# Altium schematic sheet H17R0_Frontend.SchDoc: H17R0
size Letter; CompanyName: Hexabitz; DocumentNumber: 2; Revision: 1; SheetNumber: 2; SheetTotal: 3
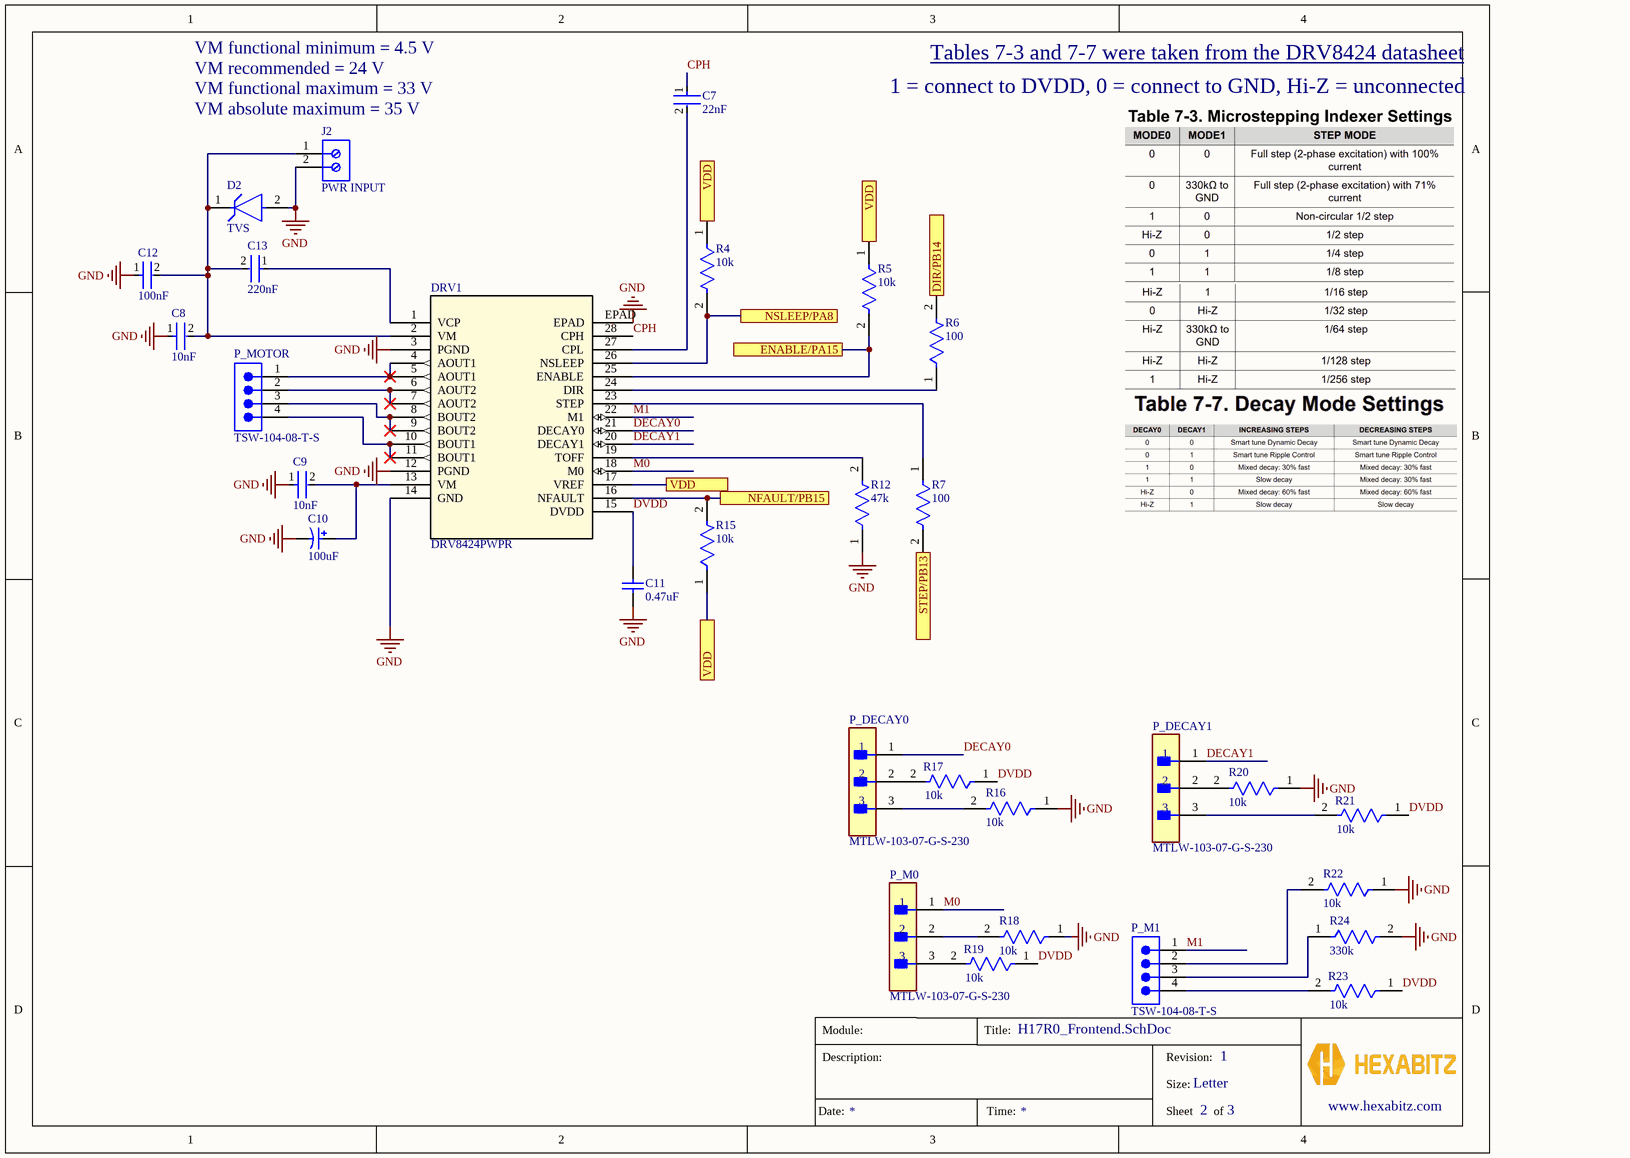
[diagram p0: H17R0_Frontend.SchDoc]

## Parts
C7  22nF  [FP-C0603C-CF-MFG]
C8  10nF  [FP-CGA3E-0_3-0_1-IPC_B]
C9  10nF  [FP-CGA3E-0_3-0_1-IPC_B]
C10  100uF  [CAPPR65-500-1600X1000X1700]
C11  0.47uF  [CAPC1608X87X35LL15T15]
C12  100nF  [FP-CGA3E-0_3-0_1-MFG]
C13  220nF  [FP-CGA3E-0_3-0_1-IPC_A]
D2  TVS  [FP-SMBJ-MFG]
DRV1  DRV8424PWPR  [SOIC_24PWPR_TEX]
J2  PWR INPUT  [PHOE-1725656-2]
P_DECAY0  MTLW-103-07-G-S-230  [FP-MTLW-103-07-G-S-230-MFG]
P_DECAY1  MTLW-103-07-G-S-230  [FP-MTLW-103-07-G-S-230-MFG]
P_M0  MTLW-103-07-G-S-230  [FP-MTLW-103-07-G-S-230-MFG]
P_M1  TSW-104-08-T-S  [SMTC-TSW-104-08-X-S]
P_MOTOR  TSW-104-08-T-S  [SMTC-TSW-104-08-X-S]
R4  10k  [FP-CRGCQ0603-IPC_C]
R5  10k  [FP-CRGCQ0603-IPC_C]
R6  100  [FP-RMCF0603-IPC_A]
R7  100  [FP-RMCF0603-IPC_A]
R12  47k  [FP-ESR03-IPC_C]
R15  10k  [FP-CRGCQ0603-IPC_C]
R16  10k  [FP-CRGCQ0603-IPC_C]
R17  10k  [FP-CRGCQ0603-IPC_C]
R18  10k  [FP-CRGCQ0603-IPC_C]
R19  10k  [FP-CRGCQ0603-IPC_C]
R20  10k  [FP-CRGCQ0603-IPC_C]
R21  10k  [FP-CRGCQ0603-IPC_C]
R22  10k  [FP-CRGCQ0603-IPC_C]
R23  10k  [FP-CRGCQ0603-IPC_C]
R24  330k  [FP-ESR03-IPC_C]

## Ports
DIR/PB14, ENABLE/PA15, NFAULT/PB15, NSLEEP/PA8, STEP/PB13, VDD

## Nets
GND: C8.1 C9.1 C10.2 C11.1 C12.1 D2.2(A) DRV1.3(PGND) DRV1.12(PGND) DRV1.14(GND) DRV1.EPAD J2.2 R12.1 R16.1 R18.1 R20.1 R22.1 R24.2
CPH: C7.1 DRV1.28(CPH)
DECAY0: DRV1.21(DECAY0) P_DECAY0.1
DECAY1: DRV1.20(DECAY1) P_DECAY1.1
DIR/PB14: R6.2 ; port DIR/PB14
DVDD: C11.2 DRV1.15(DVDD) R17.1 R19.1 R21.1 R23.1
ENABLE/PA15: DRV1.25(ENABLE) R5.2 ; port ENABLE/PA15
M0: DRV1.18(M0) P_M0.1
M1: DRV1.22(M1) P_M1.1
NFAULT/PB15: DRV1.16(NFAULT) R15.2 ; port NFAULT/PB15
NSLEEP/PA8: DRV1.26(NSLEEP) R4.2 ; port NSLEEP/PA8
STEP/PB13: R7.2 ; port STEP/PB13
VDD: DRV1.17(VREF) R4.1 R5.1 R15.1 ; port VDD
NetC7_2: C7.2 DRV1.27(CPL)
NetC8_2: C8.2 C12.2 C13.2 D2.1(C) DRV1.2(VM) J2.1
NetC9_2: C9.2 C10.1 DRV1.13(VM)
NetC13_1: C13.1 DRV1.1(VCP)
NetDRV1_4: DRV1.4(AOUT1) DRV1.5(AOUT1) P_MOTOR.1
NetDRV1_6: DRV1.6(AOUT2) DRV1.7(AOUT2) P_MOTOR.2
NetDRV1_8: DRV1.8(BOUT2) DRV1.9(BOUT2) P_MOTOR.3
NetDRV1_10: DRV1.10(BOUT1) DRV1.11(BOUT1) P_MOTOR.4
NetDRV1_19: DRV1.19(TOFF) R12.2
NetDRV1_23: DRV1.23(STEP) R7.1
NetDRV1_24: DRV1.24(DIR) R6.1
NetP_DECAY0_2: P_DECAY0.2 R17.2
NetP_DECAY0_3: P_DECAY0.3 R16.2
NetP_DECAY1_2: P_DECAY1.2 R20.2
NetP_DECAY1_3: P_DECAY1.3 R21.2
NetP_M0_2: P_M0.2 R18.2
NetP_M0_3: P_M0.3 R19.2
NetP_M1_2: P_M1.2 R22.2
NetP_M1_3: P_M1.3 R24.1
NetP_M1_4: P_M1.4 R23.2

## Notes on the sheet
- VM functional minimum = 4.5 V
- VM recommended = 24 V
- VM functional maximum = 33 V
- 1 = connect to DVDD, 0 = connect to GND, Hi-Z = unconnected
- Tables 7-3 and 7-7 were taken from the DRV8424 datasheet <https://www.ti.com/lit/ds/symlink/drv8424.pdf?ts=1762636116343&ref_url=https%253A%252F%252Fwww.ti.com%252Fproduct%252FDRV8424>
- (near J2) VM absolute maximum = 35 V
- Module:
- Title:
- Description:
- Size:
- Revision:
- Letter
- www.hexabitz.com
- Date:
- Time:
- Sheet
- of

## Library data of the parts
C7 = CMP-1035-02417-2: C0603 22,000 pF X7R 30ppm/°C 10.00% 16 V; Manufacturer: KEMET; Manufacturer Part Number: C0603C223K4RAC; Tolerance: 0.1; Automotive Grade: Grade 1; Material: Ceramic; Voltage Rating: 16 V; Lead Free: Yes; Value: 22,000 pF; Automotive: Yes; Device Class L2: Capacitors; Temperature Range Low: -55°C; Octopart: https://octopart.com/c0603c223k4rac-kemet-967635; Mouser Description: Multilayer Ceramic Capacitors MLCC - SMD/SMT 16volts 0.022uF 10% X7R; Category: Cap; Height: 0.87mm; Temperature Characteristic: X7R; Temperature: -55°C to +125°C; Temperature Coefficient: 30ppm/°C; Temperature Range High: +125°C; Device Class L3: Ceramic Capacitors; Package: C0603C-CF; Device Class L1: Passive Components; ComponentLink2URL: https://api.kemet.com/component-edge/download/datasheet/C0603C100J5GACAUTO.pdf; RoHS: TRUE; Capacitance: 22,000 pF; ComponentLink2Description: Datasheet
C8 C9 = CMP-08246-000510-1: Cap Ceramic 10nF 50V X7R 10% Pad SMD 0603 +125°C Automotive T/R; MPN: CGA3E2X7R1H103K080AE; MFN: TDK; Termination: SMD/SMT; Min Operating Temperature: -55°C; Weight: 7.1E-05oz; Capacitance: 10nF; Mount: Surface Mount; Package Quantity: 4000; Max Operating Temperature: 125°C; Voltage Rating: 50V; Tolerance: 10%; Packaging: Tape and Reel; Height: 0.8mm; Length: 0.063inch; Features: Soft Termination; Voltage Rating (DC): 50V; Case/Package: 0603; Thickness: 0.035inch; Ratings: AEC-Q200; Case Code (Imperial): 0603; Width: 0.031inch; Dielectric: X7R; Case Code (Metric): 1608
  C8: Octopart URL: https://octopart.com/part/tdk/CGA3E2X7R1H103K080AE
  C9: Octopart URL: https://octopart.com/cga3e2x7r1h103k080ae-tdk-31387966
C10 = CMP-1665-00044-1: Aluminum Electrolytic Capacitor, 100 uF, +/- 20%, 100 V, -40 to 85 degC, 2-Pin THD, RoHS, Bulk; MPN: ECA-2AM101; Power Rating: 250 mW; Tolerance: 1%; Resistance: 100 Ohm; Type (Resistor): Carbon Film; Voltage Rating: 250 V; Case\Package: Axial; MFN: Panasonic; RoHSCompliant: true; Max Operating Temperature: 155 degC; DatasheetVersion: Mar-16; PackageDescription: 2-Pin Through Hole Device, Dia 10 mm, Body Length 16 mm; ComponentLink1Description: Manufacturer URL; Package Quantity: 200; Mount: Through Hole; ComponentLink2URL: https://industrial.panasonic.com/cdbs/www-data/pdf/RDF0000/ABA0000C1047.pdf; Packaging: Bulk; Length: 0.248 inch; PackageReference: CAPPR65-500-1600X1000X1700; ComponentLink2Description: Datasheet; Min Operating Temperature: -55 degC; ComponentLink1URL: http://www.panasonic.com/; Octopart URL: https://octopart.com/part/panasonic/ECA-2AM101
C11 = CMP-2006-03770-1: Ceramic Capacitor, Multilayer, Ceramic, 6.3V, 10% +Tol, 10% -Tol, X7R, 15% TC, 0.47uF, Surface Mount, 0603; Part Number: C0603C474K9RACTU; Manufacturer: Kemet; Octopart URL: https://octopart.com/part/kemet/C0603C474K9RACTU
C12 = CMP-08246-001259-1: Cap Ceramic 100nF 50V X7R 10% Pad SMD 0603 +125°C Automotive T/R; MPN: CGA3E2X7R1H104K080AD; MFN: TDK; Weight: 7.1E-05oz; Case Code (Imperial): 0603; Min Operating Temperature: -55°C; Packaging: Tape and Reel; Dielectric: X7R; Tolerance: 10%; Case Code (Metric): 1608; Max Operating Temperature: 125°C; Composition: Ceramic; Capacitance: 100nF; Termination: SMD/SMT; Length: 1.6mm; Height: 0.8mm; Case/Package: 0603; Thickness: 0.035inch; Mount: Surface Mount; Voltage Rating (DC): 50V; Width: 0.8mm; Ratings: AEC-Q200; Voltage Rating: 50V; Depth: 0.8mm; Package Quantity: 4000; Octopart URL: https://octopart.com/part/tdk/CGA3E2X7R1H104K080AD
C13 = CMP-08246-000144-1: Cap Ceramic 220nF 16V X7R 10% Pad SMD 0603 +125°C Automotive T/R; MPN: CGA3E2X7R1C224K080AA; MFN: TDK; Capacitance: 220nF; Voltage Rating: 16V; REACH SVHC: No SVHC; Length: 1.6mm; Packaging: Tape and Reel; Depth: 0.8mm; Tolerance: 10%; Mount: Surface Mount; Dielectric: X7R; Weight: 7.1E-05oz; Thickness: 0.035inch; Voltage Rating (DC): 16V; Case/Package: 0603; Case Code (Imperial): 0603; Min Operating Temperature: -55°C; Height: 0.8mm; Max Operating Temperature: 125°C; Ratings: AEC-Q200; Package Quantity: 1; Case Code (Metric): 1608; Width: 0.8mm; Termination: SMD/SMT; Composition: Ceramic; Octopart URL: https://octopart.com/part/tdk/CGA3E2X7R1C224K080AA
D2 = CMP-2000-07095-2: TVS DIODE 33V 53.3V DO214AA; Manufacturer Part Number: SMBJ33A; Manufacturer: Littelfuse Inc; Max Junction Temp: +150°C; Number Of Channels: 1; Breakdown Voltage: 36.7V; Peak Pulse Power: 600W; Direction: Unidirectional; Peak Pulse Current: 11.3A; Lead Free: Yes; Height: 2.61mm; Temperature Range Low: -65°C; ComponentLink2URL: https://www.littelfuse.com/~/media/electronics/datasheets/tvs_diodes/littelfuse_tvs_diode_smbj_datasheet.pdf.pdf; Clamping Voltage: 53.3V; Device Class L1: Circuit Protection; Octopart: https://octopart.com/smbj33a-littelfuse-350829; Device Class L2: TVS Diodes; Digikey Description: TVS DIODE 33V 53.3V DO214AA; Automotive: No; Temperature Range High: +150°C; Package: SMBJ; ComponentLink2Description: Datasheet; Mouser Description: TVS DIODE 33V 53.3V DO214AA; Reverse Standoff Voltage: 33V; Category: Diode; Device Class L3: unset; Temperature: -65°C to +150°C; RoHS: TRUE; Octopart URL: https://octopart.com/part/littelfuse/SMBJ33A
DRV1 = DRV8424PWPR: 35-V, 2.5-A bipolar stepper driver with integrated current sensing & 1/256 microstepping 28-HTSSOP -40 to 125; Manufacturer_Name: Texas Instruments; Copyright: Copyright (C) 2025 Ultra Librarian. All rights reserved.; Manufacturer_Part_Number: DRV8424PWPR; Datasheet: https://www.ti.com/lit/gpn/drv8424; RefDes: RefDes; Type: Type
J2 = CMP-2000-05299-1: Male Header, Pitch 2.54 mm, 1 x 2 Position, Height 9 mm, Tail Length 3.5 mm; Manufacturer part No.: 1725656; Manufacturer: Phoenix Contact; Number of contacts: 2; Content: 250pc(s); Pitch: 2.54mm; Industrial packaging: Yes; Colour: Green; Type: MPT0,5/2-2,54; Datasheet URL: http://datasheet.octopart.com/1725656-Phoenix-Contact-datasheet-5302866.pdf; Manufacturer URL: http://www.phoenixcontact.com/; Datasheet Version: Apr-08; Octopart URL: https://octopart.com/part/phoenix-contact/1725656
P_DECAY0 P_DECAY1 P_M0 = CMP-02766-001679-1: CONN HEADER VERT 3POS 2.54MM; Max Current Rating: 3A; Number of Contacts: 3; Gender: Male; MFN: Samtec; Contact Material: Bronze; Pitch: 2.54mm; Housing Material: Polymer; Contact Plating: Gold; Radiation Hardening: No; Depth: 2.48mm; Packaging: Bulk; Number of Rows: 1; Max Operating Temperature: 125°C; Housing Color: Black; Termination: Solder; Min Operating Temperature: -55°C; Length: 7.62mm; RoHS Compliant: Yes; Orientation: Straight; Octopart URL: https://octopart.com/part/samtec/MTLW-103-07-G-S-230; MPN: MTLW-103-07-G-S-230
P_M1 P_MOTOR = CMP-1024-00356-1: 0.025" SQ Post Header, Through-hole, Vertical, -55 to 105 degC, 2.54 mm Pitch, 4-Pin, Male, RoHS; Manufacturer: Samtec; Pitch: 2.54 mm; PackageDescription: .025[0.64] SQ. Post Terminal Strip Assembly; ComponentLink2URL: http://www.samtec.com/documents/webfiles/pdf/TSW_TH.PDF; ComponentLink3URL: http://www.samtec.com/documents/webfiles/cpdf/TSW-XXX-XX-XXX-X-XX-XXX-MKT.pdf; PackageVersion: DM, 8/1988; ComponentLink3Description: Package Specification; DatasheetVersion: F-214; Orientation: Vertical; RoHS: True; Mounting Technology: Through-hole; ComponentLink1URL: http://www.samtec.com; PartNumber: TSW-104-08-T-S; ComponentLink1Description: Manufacturer URL; Temperature Range: -55 to 105 degC; ComponentLink2Description: Datasheet; PackageReference: TSW-104-08-X-S; Octopart URL: https://octopart.com/part/samtec/TSW-104-08-T-S
R4 R5 R15-R23 = CMP-03211-009884-1: CRGCQ 0603 10K 5%; Manufacturer Part Number: CRGCQ0603J10K; Manufacturer: TE Connectivity; Tolerance: 0.05; Power Rating: 0.1W; Resistance: 10KΩ; Voltage Rating: 75V; Value: 10KΩ; Temperature Coefficient: ±100ppm/°C; Composition: Thick Film; ComponentLink2URL: https://www.te.com/commerce/DocumentDelivery/DDEController?Action=showdoc&DocId=Data+Sheet%7F1773204-3%7F1%7Fpdf%7FEnglish%7FENG_DS_1773204-3_1.pdf%7F4-2176339-923; Device Class L1: Passive Components; Package: CRGCQ0603; Mouser Description: Res Thick Film 0603 10K Ohm 5% 0.1W(1/10W) ±100ppm/C Pad SMD Automotive T/R; Temperature Range High: +155°C; Category: Res; Device Class L2: Resistors; Height: 0.55mm; RoHS: TRUE; Lead Free: Yes; Ipc Land Pattern Name: RESC16080X45; Temperature: -55°C to +155°C; Series: CRGCQ; Digikey Description: CRGCQ 0603 10K 5%; Octopart: https://octopart.com/crgcq0603j10k-te+connectivity-91018097; Device Class L3: Chip SMD Resistors; Ambient Temperature Range High: +70°C; ComponentLink2Description: Datasheet; Temperature Range Low: -55°C
R6 R7 = CMP-26527-004540-1: 100Ω ±5% 0.1W 0603 Thick Film Chip Resistor AEC-Q200 compliant; MPN: RMCF0603JT100R; Resistance: 100R; Power Rating: 100mW; Temperature Coefficient: 100ppm/°C; MFN: Stackpole Electronics; Case Code (Imperial): 0603; Min Operating Temperature: -55°C; RoHS Compliant: Yes; Size Code: 0603; Radiation Hardening: No; Construction: Rectangular; Resistor Type: Thick Film; Max Operating Temperature: 155°C; Packaging: Tape and Reel; Height: 0.022inch; Military Standard: Not; Case Code (Metric): 1608; Max Power Dissipation: 100mW; Contact Plating: Tin; Features: Automotive AEC-Q200; Number of Terminations: 2; Mount: Surface Mount; Length: 1.55mm; Width: 0.031inch; Tolerance: 5%; Depth: 0.8mm; Lead Free: Lead Free; Series: RMCF; Case/Package: 0603; Octopart URL: https://octopart.com/part/stackpole-electronics/RMCF0603JT100R
R12 = CMP-08839-028279-1: 47kΩ ±5% 0.25W 0603 Anti-Surge Chip Resistor AEC-Q200; MPN: ESR03EZPJ473; Resistance: 47kR; Max Power Dissipation: 250mW; Temperature Coefficient: 200ppm/°C; MFN: ROHM; Series: ESR; Number of Terminations: 2; Min Operating Temperature: -55°C; Features: Automotive AEC-Q200; Width: 0.031inch; Case Code (Imperial): 0603; Case/Package: 0603; Packaging: Tape and Reel; Resistor Type: Thick Film; Length: 0.063inch; Tolerance: 5%; Package Quantity: 1; Max Operating Temperature: 155°C; Height: 0.022inch; Case Code (Metric): 1608; RoHS Compliant: Yes; Octopart URL: https://octopart.com/part/rohm/ESR03EZPJ473
R24 = CMP-08839-028995-1: 330kΩ ±5% 0.25W 0603 Anti-Surge Chip Resistor AEC-Q200; MPN: ESR03EZPJ334; Max Power Dissipation: 250mW; Temperature Coefficient: 200ppm/°C; Resistance: 330kR; MFN: ROHM; Min Operating Temperature: -55°C; Case Code (Metric): 1608; Resistor Type: Thick Film; Case/Package: 0603; Features: Automotive AEC-Q200; RoHS Compliant: Yes; Tolerance: 5%; Number of Terminations: 2; Packaging: Tape and Reel; Series: ESR; Case Code (Imperial): 0603; Max Operating Temperature: 155°C; Length: 0.063inch; Height: 0.022inch; Width: 0.031inch; Package Quantity: 5000; Octopart URL: https://octopart.com/part/rohm/ESR03EZPJ334